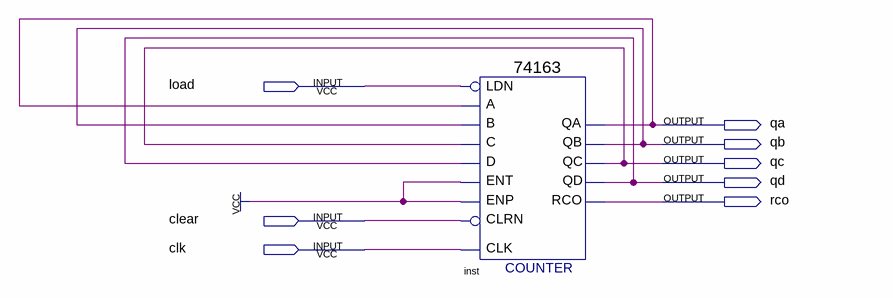
[diagram p0: schematic sheet]
// Quartus schematic CounterRCO.bdf as structural Verilog: 1 symbols, 8 pins
module CounterRCO (
  input  load,
  input  clear,
  input  clk,
  output qa,
  output qb,
  output qc,
  output qd,
  output rco
);

  \74163  inst (
    .C(qc), .B(qb), .A(qa), .ENT(1'b1), .D(qd), .CLRN(clear), .CLK(clk), .ENP(1'b1), .LDN(load), .QA(qa),
    .QB(qb), .QC(qc), .QD(qd), .RCO(rco));
endmodule
